# EAGLE schematic StrobeV4 (EAGLE 8.3.2)
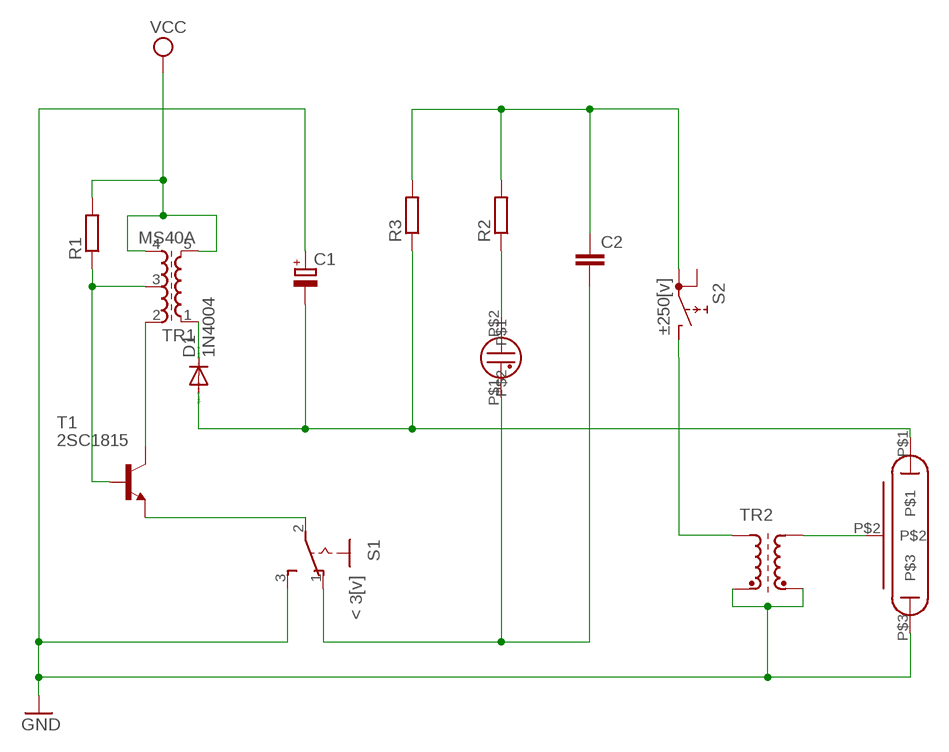
[diagram p0: schematic, sheet 1]

## Parts
C1  CPOL-EU140CLH-0810  [140CLH-0810]
C2  C-EU150-054X183  [C150-054X183]
D1  1N4004  [DO41-10]
R1  R-EU_0204/2V  [0204V]
R2  R-EU_0204/2V  [0204V]
R3  R-EU_0204/2V  [0204V]
S1  < 3[v]  255SB  [255SB]
S2  ±250[v]  RDT1034  [RDT1034]
T1  2SC1815  [TO92-ECB]
TR1  MS40A  [MS40]
TR2  SM-T4  [SM-T4]
U$1  XENON  [XENON]
U$2  NEON  [NEON]

## Nets
GND: C1.+ S1.3(S) TR2.2(E1) TR2.4(E2) U$1.P$3
N$1: C1.- D1.A R3.1 U$1.P$1
N$2: S1.2(P) T1.E
N$3: C2.2 S1.1(O) U$2.P$1
N$5: C2.1 R2.2 R3.2 S2.A1
N$6: T1.C TR1.2
N$7: R2.1 U$2.P$2
N$8: R1.1 T1.B TR1.3
N$9: D1.C TR1.1
N$10: S2.B TR2.1(A1)
N$11: TR2.5(A2) U$1.P$2
VCC: R1.2 TR1.4 TR1.5
Unconnected: S2.A

## Library data of the parts
C1 = rcl:CPOL-EU: POLARIZED CAPACITOR, European symbol
C2 = rcl:C-EU: CAPACITOR, European symbol
D1 = diode:1N4004: DIODE general purpose rectifier, 1 A
R1-R3 = rcl:R-EU_: RESISTOR, European symbol
S1 = switch:255SB: SLIDING SWITCH Distributor Buerklin, 11G810
S2 = switch:RDT1034: PUSH SWITCH www.radiohm.com
T1 = transistor:2SC1815: NPN EPITAXIAL TRANSISTOR Source: TOSHIBA .. 2SC1815 1.pdf
TR1 = inductor-neosid:MS40: TRANSFORMER SMD transformer acc. to customer specification; OC_FARNELL: unknown; OC_NEWARK: unknown
TR2 = inductor-neosid:SM-T4: TRANSFORMER SMD wideband transformer; OC_FARNELL: unknown; OC_NEWARK: unknown
U$1 = getter-lamp:XENON
U$2 = getter-lamp:NEON